# EAGLE design ir_validator (EAGLE 9.6.2)
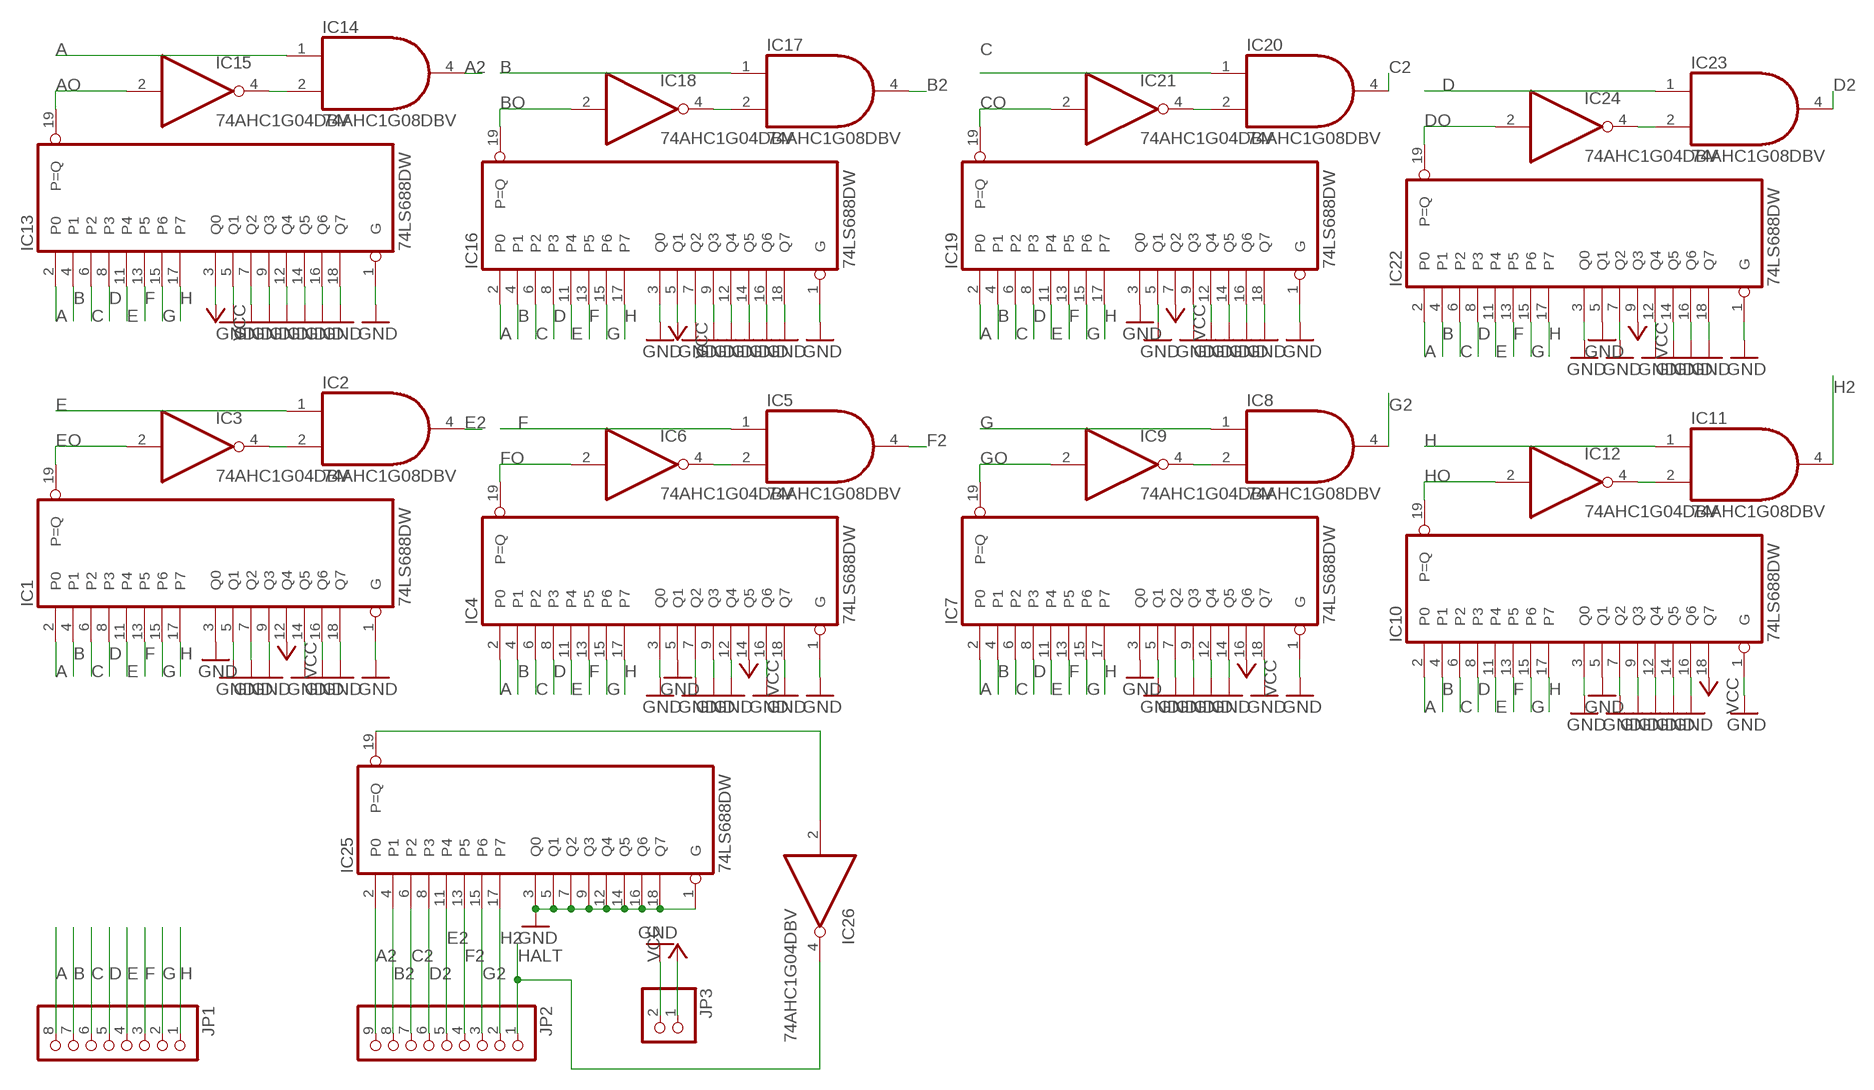
[diagram p0: schematic, sheet 1]

## Parts
IC1  74LS688DW  [SO20W]
IC2  74AHC1G08DBV  [SOT23-5]
IC3  74AHC1G04DBV  [SOT23-5]
IC4  74LS688DW  [SO20W]
IC5  74AHC1G08DBV  [SOT23-5]
IC6  74AHC1G04DBV  [SOT23-5]
IC7  74LS688DW  [SO20W]
IC8  74AHC1G08DBV  [SOT23-5]
IC9  74AHC1G04DBV  [SOT23-5]
IC10  74LS688DW  [SO20W]
IC11  74AHC1G08DBV  [SOT23-5]
IC12  74AHC1G04DBV  [SOT23-5]
IC13  74LS688DW  [SO20W]
IC14  74AHC1G08DBV  [SOT23-5]
IC15  74AHC1G04DBV  [SOT23-5]
IC16  74LS688DW  [SO20W]
IC17  74AHC1G08DBV  [SOT23-5]
IC18  74AHC1G04DBV  [SOT23-5]
IC19  74LS688DW  [SO20W]
IC20  74AHC1G08DBV  [SOT23-5]
IC21  74AHC1G04DBV  [SOT23-5]
IC22  74LS688DW  [SO20W]
IC23  74AHC1G08DBV  [SOT23-5]
IC24  74AHC1G04DBV  [SOT23-5]
IC25  74LS688DW  [SO20W]
IC26  74AHC1G04DBV  [SOT23-5]
JP1  PINHD-1X8  [1X08]
JP2  PINHD-1X9  [1X09]
JP3  PINHD-1X2  [1X02]

## Nets
A: IC1.2(P0) IC4.2(P0) IC7.2(P0) IC10.2(P0) IC13.2(P0) IC14.1(I0) IC16.2(P0) IC19.2(P0) IC22.2(P0) JP1.8
A2: IC14.4(O) IC25.2(P0) JP2.9
AO: IC13.19(P=Q) IC15.2(I)
B: IC1.4(P1) IC4.4(P1) IC7.4(P1) IC10.4(P1) IC13.4(P1) IC16.4(P1) IC17.1(I0) IC19.4(P1) IC22.4(P1) JP1.7
B2: IC17.4(O) IC25.4(P1) JP2.8
BO: IC16.19(P=Q) IC18.2(I)
C: IC1.6(P2) IC4.6(P2) IC7.6(P2) IC10.6(P2) IC13.6(P2) IC16.6(P2) IC19.6(P2) IC20.1(I0) IC22.6(P2) JP1.6
C2: IC20.4(O) IC25.6(P2) JP2.7
CO: IC19.19(P=Q) IC21.2(I)
D: IC1.8(P3) IC4.8(P3) IC7.8(P3) IC10.8(P3) IC13.8(P3) IC16.8(P3) IC19.8(P3) IC22.8(P3) IC23.1(I0) JP1.5
D2: IC23.4(O) IC25.8(P3) JP2.6
DO: IC22.19(P=Q) IC24.2(I)
E: IC1.11(P4) IC2.1(I0) IC4.11(P4) IC7.11(P4) IC10.11(P4) IC13.11(P4) IC16.11(P4) IC19.11(P4) IC22.11(P4) JP1.4
E2: IC2.4(O) IC25.11(P4) JP2.5
EO: IC1.19(P=Q) IC3.2(I)
F: IC1.13(P5) IC4.13(P5) IC5.1(I0) IC7.13(P5) IC10.13(P5) IC13.13(P5) IC16.13(P5) IC19.13(P5) IC22.13(P5) JP1.3
F2: IC5.4(O) IC25.13(P5) JP2.4
FO: IC4.19(P=Q) IC6.2(I)
G: IC1.15(P6) IC4.15(P6) IC7.15(P6) IC8.1(I0) IC10.15(P6) IC13.15(P6) IC16.15(P6) IC19.15(P6) IC22.15(P6) JP1.2
G2: IC8.4(O) IC25.15(P6) JP2.3
GND: IC1.1(G) IC1.3(Q0) IC1.5(Q1) IC1.7(Q2) IC1.9(Q3) IC1.14(Q5) IC1.16(Q6) IC1.18(Q7) IC4.1(G) IC4.3(Q0) IC4.5(Q1) IC4.7(Q2) IC4.9(Q3) IC4.12(Q4) IC4.16(Q6) IC4.18(Q7) IC7.1(G) IC7.3(Q0) IC7.5(Q1) IC7.7(Q2) IC7.9(Q3) IC7.12(Q4) IC7.14(Q5) IC7.18(Q7) IC10.1(G) IC10.3(Q0) IC10.5(Q1) IC10.7(Q2) IC10.9(Q3) IC10.12(Q4) IC10.14(Q5) IC10.16(Q6) IC13.1(G) IC13.5(Q1) IC13.7(Q2) IC13.9(Q3) IC13.12(Q4) IC13.14(Q5) IC13.16(Q6) IC13.18(Q7) IC16.1(G) IC16.3(Q0) IC16.7(Q2) IC16.9(Q3) IC16.12(Q4) IC16.14(Q5) IC16.16(Q6) IC16.18(Q7) IC19.1(G) IC19.3(Q0) IC19.5(Q1) IC19.9(Q3) IC19.12(Q4) IC19.14(Q5) IC19.16(Q6) IC19.18(Q7) IC22.1(G) IC22.3(Q0) IC22.5(Q1) IC22.7(Q2) IC22.12(Q4) IC22.14(Q5) IC22.16(Q6) IC22.18(Q7) IC25.1(G) IC25.3(Q0) IC25.5(Q1) IC25.7(Q2) IC25.9(Q3) IC25.12(Q4) IC25.14(Q5) IC25.16(Q6) IC25.18(Q7) JP3.2
GO: IC7.19(P=Q) IC9.2(I)
H: IC1.17(P7) IC4.17(P7) IC7.17(P7) IC10.17(P7) IC11.1(I0) IC13.17(P7) IC16.17(P7) IC19.17(P7) IC22.17(P7) JP1.1
H2: IC11.4(O) IC25.17(P7) JP2.2
HALT: IC26.4(O) JP2.1
HO: IC10.19(P=Q) IC12.2(I)
N$1: IC25.19(P=Q) IC26.2(I)
N$2: IC2.2(I1) IC3.4(O)
N$4: IC5.2(I1) IC6.4(O)
N$6: IC8.2(I1) IC9.4(O)
N$8: IC11.2(I1) IC12.4(O)
N$10: IC14.2(I1) IC15.4(O)
N$12: IC17.2(I1) IC18.4(O)
N$14: IC20.2(I1) IC21.4(O)
N$16: IC23.2(I1) IC24.4(O)
VCC: IC1.12(Q4) IC4.14(Q5) IC7.16(Q6) IC10.18(Q7) IC13.3(Q0) IC16.5(Q1) IC19.7(Q2) IC22.9(Q3) JP3.1

## Power pins joined to a net without a drawn wire
GND: IC1.10(GND) IC2.3(GND) IC3.3(GND) IC4.10(GND) IC5.3(GND) IC6.3(GND) IC7.10(GND) IC8.3(GND) IC9.3(GND) IC10.10(GND) IC11.3(GND) IC12.3(GND) IC13.10(GND) IC14.3(GND) IC15.3(GND) IC16.10(GND) IC17.3(GND) IC18.3(GND) IC19.10(GND) IC20.3(GND) IC21.3(GND) IC22.10(GND) IC23.3(GND) IC24.3(GND) IC25.10(GND) IC26.3(GND)
VCC: IC1.20(VCC) IC2.5(VCC) IC3.5(VCC) IC4.20(VCC) IC5.5(VCC) IC6.5(VCC) IC7.20(VCC) IC8.5(VCC) IC9.5(VCC) IC10.20(VCC) IC11.5(VCC) IC12.5(VCC) IC13.20(VCC) IC14.5(VCC) IC15.5(VCC) IC16.20(VCC) IC17.5(VCC) IC18.5(VCC) IC19.20(VCC) IC20.5(VCC) IC21.5(VCC) IC22.20(VCC) IC23.5(VCC) IC24.5(VCC) IC25.20(VCC) IC26.5(VCC)

## Library data of the parts
IC1 IC4 IC7 IC10 IC13 IC16 IC19 IC22 IC25 = 74xx-us:74*688: 8-bit MAGNITUDE/IDENTITY COMPARATOR, totem pole
IC2 IC5 IC8 IC11 IC14 IC17 IC20 IC23 = 74xx-little-us:74*1G08: 2-input AND gate
IC3 IC6 IC9 IC12 IC15 IC18 IC21 IC24 IC26 = 74xx-little-us:74*1G04: INVERTER Gate
JP1 = pinhead:PINHD-1X8: PIN HEADER
JP2 = pinhead:PINHD-1X9: PIN HEADER
JP3 = pinhead:PINHD-1X2: PIN HEADER

## Board
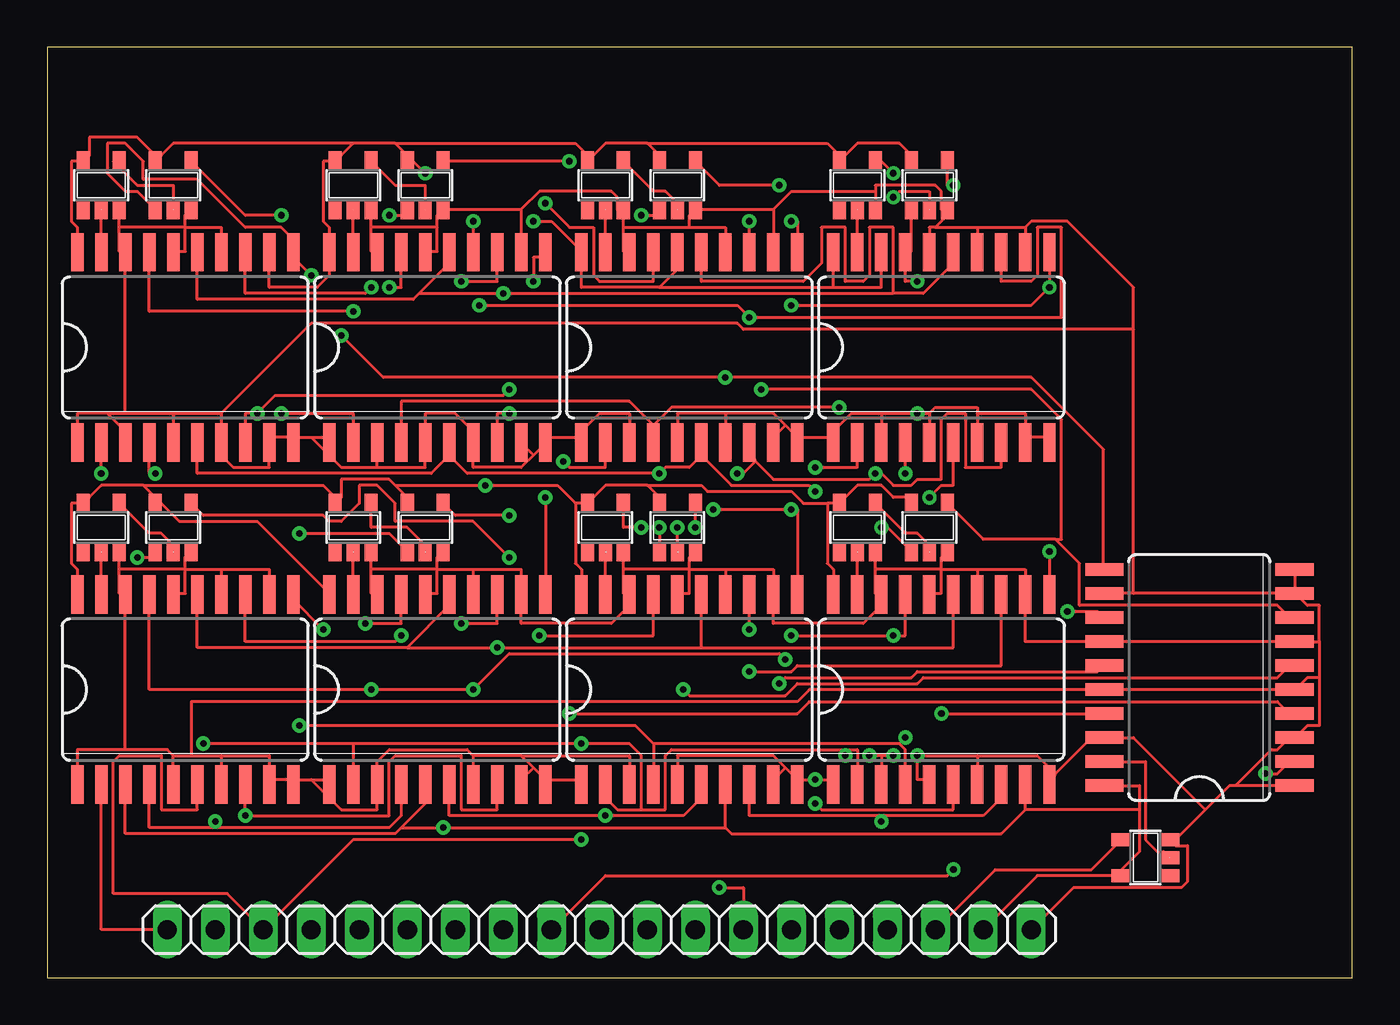
[diagram p1: board, top side]
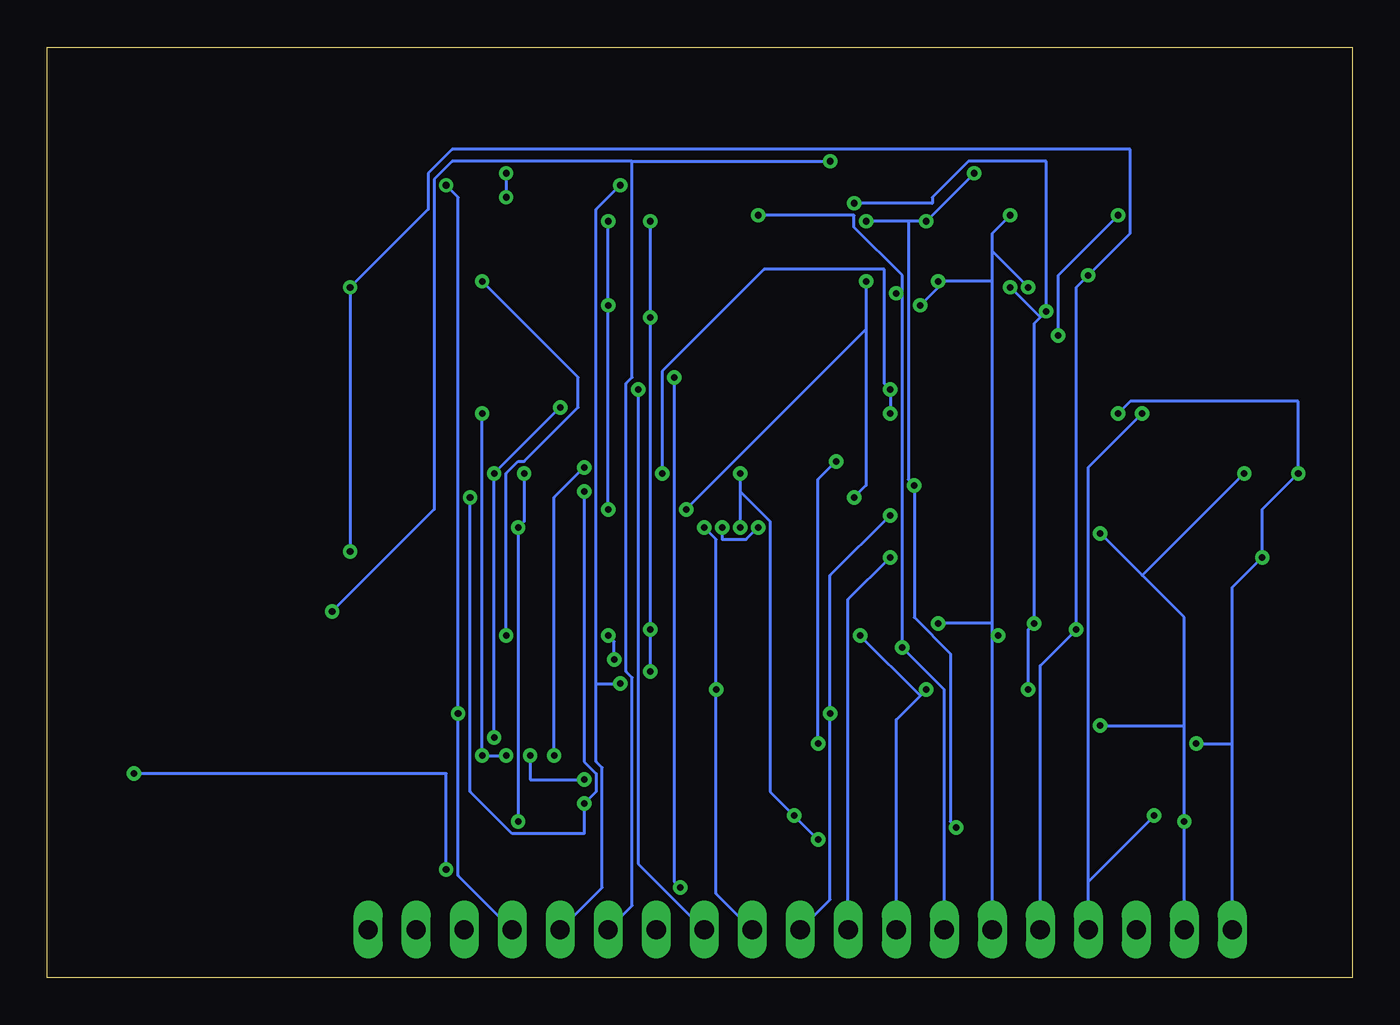
[diagram p2: board, bottom side, seen from below]

Size 69.05 x 49.21 mm. Coordinates in mm from the lower left corner, seen from the top.
Outline: 0,49.21 0,0 69.05,0 69.05,49.2 0,49.2
Copper layers (1*16): Top 0.035mm / dielectric 1.5mm / Bottom 0.035mm
Design rules "default": minimum track width 6mil, minimum drill 0.35mm, track to track 6mil, track to pad 6mil, pad to pad 6mil, via to via 6mil, smd to smd 6mil, copper to edge 40mil, drill to drill 6mil, minimum pad ring 10mil, minimum via ring 8mil, stop-mask expansion 4mil, vias tented up to drill 0mil, thermal gap 10mil

### Footprints (pad centres in the part's own frame; a part is rotated, then mirrored left to right if it is on the bottom)
SO20W = smd 0.66 x 2.032: 1 -5.715,-5.029; 2 -4.445,-5.029; 3 -3.175,-5.029; 4 -1.905,-5.029; 5 -0.635,-5.029; 6 0.635,-5.029; 7 1.905,-5.029; 8 3.175,-5.029; 9 4.445,-5.029; 10 5.715,-5.029; 11 5.715,5.029; 12 4.445,5.029; 13 3.175,5.029; 14 1.905,5.029; 15 0.635,5.029; 16 -0.635,5.029; 17 -1.905,5.029; 18 -3.175,5.029; 19 -4.445,5.029; 20 -5.715,5.029
SOT23-5 = smd 0.69 x 0.99: 1 -0.95,-1.29; 2 0,-1.29; 3 0.95,-1.29; 4 0.95,1.3; 5 -0.95,1.3
1X08 = drill 1.016 long: 1 -8.89,0; 2 -6.35,0; 3 -3.81,0; 4 -1.27,0; 5 1.27,0; 6 3.81,0; 7 6.35,0; 8 8.89,0
1X09 = drill 1.016 long: 1 -10.16,0; 2 -7.62,0; 3 -5.08,0; 4 -2.54,0; 5 0,0; 6 2.54,0; 7 5.08,0; 8 7.62,0; 9 10.16,0
1X02 = drill 1.016 long: 1 -1.27,0; 2 1.27,0

### Placement (x,y rotation side)
IC1  7.3,33.34 0 top
IC2  6.67,41.91 0 top
IC3  2.86,41.91 0 top
IC4  20.64,33.34 0 top
IC5  20,41.91 0 top
IC6  16.19,41.91 0 top
IC7  33.97,33.34 0 top
IC8  33.34,41.91 0 top
IC9  29.53,41.91 0 top
IC10  47.31,33.34 0 top
IC11  46.67,41.91 0 top
IC12  42.86,41.91 0 top
IC13  7.3,15.24 0 top
IC14  6.67,23.81 0 top
IC15  2.86,23.81 0 top
IC16  20.64,15.24 0 top
IC17  20,23.81 0 top
IC18  16.19,23.81 0 top
IC19  33.97,15.24 0 top
IC20  33.34,23.81 0 top
IC21  29.53,23.81 0 top
IC22  47.31,15.24 0 top
IC23  46.67,23.81 0 top
IC24  42.86,23.81 0 top
IC25  60.96,15.88 90 top
IC26  58.1,6.35 90 top
JP1  15.24,2.54 180 top
JP2  36.83,2.54 180 top
JP3  50.8,2.54 0 top

### Tracks (layer width: path | path; a pad name or v marks a point on that pad's centre or on a via)
A  (via drill 0.35)
  Top 0.152: v4.76,22.23 5.71,22.23 IC14.1 | IC13.2 2.86,2.54 JP1.8 | v2.86,26.67 IC1.2 | IC4.2 16.19,29.84 v12.38,29.84 | 16.19,12.38 IC16.2 | 16.19,12.38 v28.26,12.38 30.8,12.38 31.43,11.75 31.43,8.89 | 31.43,8.89 30.16,8.89 29.53,9.53 IC19.2 | IC22.2 42.86,12.06 42.23,12.06 | 42.23,12.06 33.02,12.06 32.7,11.75 32.7,8.89 31.43,8.89 | IC7.2 29.53,26.99 27.62,26.99 v27.3,27.3 | IC10.2 42.86,26.99 v40.64,26.99 | 42.23,12.06 v42.23,11.75 | 16.19,12.38 v8.26,12.38
  Bottom 0.152: JP1.8 6.35,12.38 | 6.35,12.38 6.35,20.64 v4.76,22.23 4.76,24.77 v2.86,26.67 2.86,30.48 11.75,30.48 v12.38,29.84 | v27.3,27.3 28.26,26.35 v28.26,12.38 | v40.64,26.99 42.23,25.4 v42.23,11.75 | v8.26,12.38 6.35,12.38
A2  (via drill 0.35)
  Top 0.152: v24.45,22.23 22.54,24.13 18.41,24.13 18.41,25.08 17.46,26.04 16.51,26.04 16.51,25.08 15.56,24.13 14.92,24.13 14.61,24.45 8.26,24.45 7.62,25.08 IC14.4 | v64.45,10.79 65.09,10.79 65.72,11.43 IC25.2 | v47.94,5.71 47.62,5.4 29.53,5.4 JP2.9
  Bottom 0.152: v24.45,22.23 26.67,20 JP2.9 | v64.45,10.79 47.94,10.79 v47.94,5.71
AO
  Top 0.152: IC13.19 IC15.2
B  (via drill 0.35)
  Top 0.152: IC13.4 5.4,7.94 8.89,7.94 | 8.89,7.94 18.1,7.94 18.73,8.57 IC16.4 | v13.34,23.5 18.1,23.5 19.05,22.54 IC17.1 | IC1.4 5.4,26.67 v5.71,26.67 | v8.89,8.26 8.89,7.94 | IC4.4 18.73,30.48 30.8,30.48 32.07,29.21 | 32.07,29.21 IC7.4 32.07,28.57 | 32.07,12.38 IC19.4 | 45.09,12.38 32.07,12.38 | 45.09,12.38 45.4,12.06 IC22.4 | v45.4,26.67 IC10.4 | 45.09,12.38 v45.4,12.7 | 32.07,29.21 33.02,30.16 v41.91,30.16 | v13.34,13.34 31.11,13.34 32.07,12.38
  Bottom 0.152: 11.11,21.27 8.89,19.05 8.89,13.34 | 11.11,21.27 v13.34,23.5 | JP1.7 v8.89,8.26 8.89,13.34 | 11.11,21.27 v5.71,26.67 | v45.4,12.7 v45.4,26.67 v41.91,30.16 | v13.34,13.34 8.89,13.34
B2  (via drill 0.35)
  Top 0.152: v24.45,24.45 21.59,24.45 20.95,25.08 IC17.4 | v27.62,13.97 39.69,13.97 40.32,14.61 65.09,14.61 65.72,13.97 IC25.4
  Bottom 0.152: v24.45,24.45 27.62,21.27 v27.62,13.97 27.62,4.13 JP2.8
BO
  Top 0.152: IC16.19 IC18.2
C  (via drill 0.35)
  Top 0.152: IC13.6 7.94,8.89 6.03,8.89 6.03,11.75 3.81,11.75 3.49,11.43 3.49,4.45 9.53,4.45 JP1.6 16.19,7.3 v28.26,7.3 | IC1.6 7.94,26.67 20.32,26.67 21.27,27.62 | IC4.6 21.27,27.62 | IC16.6 21.27,8.57 v29.53,8.57 33.66,8.57 34.61,9.53 IC19.6 | v32.38,23.81 32.38,22.54 IC20.1 | 34.61,27.62 33.97,26.99 32.7,26.99 v32.38,26.67 22.23,26.67 21.27,27.62 | IC7.6 34.61,27.62 | IC22.6 47.94,8.89 40.96,8.89 v40.64,9.21 | v40.64,25.72 40.32,26.04 36.2,26.04 34.61,27.62 | IC10.6 47.94,26.04 47.31,26.04 v46.67,25.4
  Bottom 0.152: v32.38,26.67 32.38,25.72 | 32.38,25.72 v32.38,23.81 | v40.64,25.72 40.64,11.43 40.01,10.79 40.01,9.84 v40.64,9.21 40.64,7.62 44.45,7.62 46.67,9.84 v46.67,25.4 | 32.38,25.72 30.8,24.13 30.8,9.84 v29.53,8.57 v28.26,7.3
C2  (via drill 0.35)
  Top 0.152: v34.29,23.81 34.29,25.08 IC20.4 | v33.66,15.24 33.97,14.92 39.05,14.92 39.69,15.56 46.04,15.56 46.35,15.88 65.09,15.88 65.72,16.51 IC25.6
  Bottom 0.152: v34.29,23.81 33.66,23.18 v33.66,15.24 33.66,4.45 JP2.7
CO
  Top 0.152: IC19.19 IC21.2
D  (via drill 0.35)
  Top 0.152: IC19.8 37.15,8.57 44.13,8.57 | 44.13,8.57 49.53,8.57 50.48,9.53 IC22.8 | v44.13,23.81 44.45,23.81 45.72,22.54 IC23.1 | 37.47,27.3 37.15,27.62 IC7.8 37.47,27.3 | 37.47,27.3 38.42,26.35 43.5,26.35 v43.81,26.67 44.13,26.67 44.77,26.04 45.72,26.04 46.04,26.35 47.31,26.35 47.31,29.53 47.62,29.84 48.58,29.84 48.58,26.99 50.48,26.99 IC10.8 | v44.13,8.26 44.13,8.57 | IC13.8 v10.48,8.57 18.1,8.57 18.1,11.43 18.41,11.75 21.91,11.75 21.91,8.89 23.81,8.89 IC16.8 | IC1.8 10.48,29.84 v11.11,29.84 12.06,30.8 24.13,30.8 v24.45,31.11 | IC4.8 23.81,29.84 v24.45,29.84 | 37.47,27.3 36.83,26.67 v36.51,26.67
  Bottom 0.152: v43.81,26.67 43.81,24.13 v44.13,23.81 v44.13,8.26 | 13.97,5.08 v10.48,8.57 | JP1.5 13.97,5.08 | v11.11,29.84 13.97,26.99 13.97,5.08 | v24.45,29.84 v24.45,31.11 24.77,31.43 24.77,37.47 31.11,37.47 36.51,32.07 v36.51,26.67
D2  (via drill 0.35)
  Top 0.152: 53.34,23.18 49.53,23.18 47.62,25.08 IC23.4 | 53.34,23.18 54.61,21.91 54.61,19.68 65.09,19.68 65.72,19.05 IC25.8 | v37.78,31.11 52.07,31.11 53.66,29.53 53.66,23.18 53.34,23.18
  Bottom 0.152: JP2.6 37.78,6.03 v37.78,31.11
DO
  Top 0.152: IC22.19 IC24.2
E  (via drill 0.35)
  Top 0.152: v53.02,22.54 IC22.11 | IC10.11 v53.02,36.51 52.07,35.56 v39.37,35.56 | v26.35,25.4 IC16.11 | v25.72,36.83 25.72,38.1 26.35,38.1 IC4.11 | IC19.11 39.69,24.77 v39.37,24.77 v35.24,24.77 | IC7.11 39.69,40.01 v39.37,40.01 | IC2.1 5.71,40.64 4.76,41.59 4.13,41.59 3.17,42.55 3.17,44.13 4.13,44.13 5.08,43.18 5.08,42.23 7.94,42.23 10.48,39.69 12.38,39.69 13.02,39.05 IC1.11 13.02,38.1 v13.97,37.15 | v14.61,18.41 13.02,20 IC13.11
  Bottom 0.152: v53.02,22.54 v53.02,36.51 48.9,40.64 48.9,42.55 47.62,43.81 11.75,43.81 11.75,39.37 v13.97,37.15 14.61,36.51 v14.61,18.41 16.51,16.51 JP1.4 | v26.35,25.4 25.72,26.04 25.72,34.29 | v25.72,36.83 25.72,34.29 | 25.72,34.29 v35.24,24.77 | v39.37,24.77 v39.37,35.56 v39.37,40.01
E2  (via drill 0.35)
  Top 0.152: v12.38,40.32 10.48,40.32 7.62,43.18 IC2.4 | v15.56,33.97 17.78,31.75 v35.88,31.75 52.07,31.75 55.88,27.94 55.88,21.59 IC25.11 | JP2.5 36.83,4.76 v35.56,4.76
  Bottom 0.152: v12.38,40.32 15.56,37.15 v15.56,33.97 | v35.56,4.76 35.88,5.08 v35.88,31.75
EO
  Top 0.152: IC1.19 IC3.2
F  (via drill 0.35)
  Top 0.152: v37.15,18.41 IC19.13 | IC7.13 v37.15,40.01 | IC22.13 50.48,16.51 39.69,16.51 39.37,16.19 v37.15,16.19 | IC10.13 50.48,36.83 52.07,36.83 52.39,37.15 52.39,39.69 53.66,39.69 53.66,34.92 v37.15,34.92 36.51,35.56 v22.86,35.56 | v18.1,40.32 19.05,40.32 IC5.1 | IC13.13 10.48,17.78 18.41,17.78 v18.73,18.1 | IC16.13 23.81,18.73 v21.91,18.73 | IC1.13 10.48,36.2 16.83,36.2 v17.14,36.51 | IC4.13 23.81,36.83 v21.91,36.83
  Bottom 0.152: v37.15,40.01 v37.15,34.92 v37.15,18.41 v37.15,16.19 | v18.1,40.32 19.05,39.37 19.05,38.42 | JP1.3 19.05,18.1 | 19.05,18.1 19.05,18.73 | 19.05,18.73 19.05,36.83 | 19.05,36.83 19.05,38.42 | 19.05,18.1 v18.73,18.1 | 19.05,18.73 v21.91,18.73 | 19.05,38.42 v17.14,36.51 | 19.05,36.83 v21.91,36.83 21.91,36.51 v22.86,35.56
F2  (via drill 0.35)
  Top 0.152: v27.62,43.18 20.95,43.18 IC5.4 | v53.98,19.37 55.56,19.37 55.88,19.05 IC25.13
  Bottom 0.152: 38.1,43.18 v27.62,43.18 | 38.1,43.18 38.1,31.75 38.42,31.43 38.42,16.19 38.1,15.88 38.1,3.81 JP2.4 | v53.98,19.37 48.58,24.77 48.58,42.23 47.62,43.18 38.1,43.18
FO
  Top 0.152: IC4.19 IC6.2
G  (via drill 0.35)
  Top 0.152: IC13.15 7.94,17.46 19.05,17.46 | 19.05,17.46 21.27,19.68 IC16.15 | 34.61,17.46 IC19.15 | 19.05,17.46 v23.81,17.46 34.61,17.46 | IC22.15 47.94,17.46 34.61,17.46 | IC7.15 34.61,36.83 40.01,36.83 40.96,37.78 40.96,39.69 42.23,39.69 42.23,36.83 43.18,36.83 43.5,37.15 43.5,39.69 44.77,39.69 44.77,36.2 | 44.77,36.2 46.35,36.2 47.94,37.78 IC10.15 | IC1.15 7.94,35.88 19.37,35.88 19.68,36.2 | 19.68,36.2 21.27,37.78 IC4.15 | 19.68,36.2 v24.13,36.2 44.77,36.2 | v31.43,40.32 32.38,40.32 IC8.1
  Bottom 0.152: v31.43,40.32 26.35,40.32 26.35,39.69 23.81,37.15 23.81,36.2 | 23.81,36.2 v23.81,17.46 21.59,15.24 JP1.2 | 23.81,36.2 v24.13,36.2
G2  (via drill 0.35)
  Top 0.152: v38.73,41.91 35.56,41.91 34.29,43.18 IC8.4 | v38.73,15.56 39.05,15.88 45.72,15.88 46.04,16.19 55.56,16.19 55.88,16.51 IC25.15
  Bottom 0.152: v38.73,41.91 40.01,40.64 40.01,15.56 | 40.01,15.56 40.01,11.43 39.69,11.11 39.69,4.76 JP2.3 | 40.01,15.56 v38.73,15.56
GND  (via drill 0.35)
  Top 0.152: 61.28,8.89 62.55,10.16 62.87,10.16 | 61.28,8.89 59.69,7.3 IC26.3 59.69,6.99 60.33,6.99 60.33,5.08 60.01,4.76 54.29,4.76 JP3.2 | IC25.1 62.87,10.16 | 62.87,10.16 64.77,12.06 65.09,12.06 65.72,12.7 IC25.3 66.04,12.7 66.67,13.34 67.31,13.34 67.31,15.88 | 51.75,28.57 53.02,28.57 IC10.10 | IC7.5 33.34,29.84 35.88,29.84 | 35.88,29.84 38.42,29.84 39.05,29.21 | 39.69,28.57 39.05,29.21 | 35.88,29.84 IC7.7 | 39.05,29.21 38.42,28.57 IC7.9 | 39.69,28.57 41.27,28.57 | 41.27,28.57 41.59,28.57 IC10.1 41.27,28.57 | 39.69,28.57 IC7.10 | 44.13,29.84 IC10.3 | 44.13,29.84 42.55,29.84 41.27,28.57 | 46.67,29.84 IC10.5 | 44.13,29.84 v46.04,29.84 46.67,29.84 | 49.21,29.84 49.21,30.16 46.99,30.16 46.67,29.84 | 49.21,29.84 IC10.7 | 51.75,28.57 51.75,29.84 49.21,29.84 | 51.75,28.57 IC10.9 | IC19.5 33.34,11.75 38.42,11.75 39.05,11.11 | 39.69,10.48 39.05,11.11 | 39.05,11.11 38.42,10.48 IC19.9 | 39.69,10.48 v40.64,10.48 41.59,10.48 IC22.1 | 39.69,10.48 IC19.10 | 53.34,10.79 55.24,12.7 IC25.18 57.47,12.7 61.28,8.89 | 53.34,10.79 53.02,10.48 IC22.10 53.34,10.79 | 44.13,11.75 IC22.3 | v44.77,11.75 44.13,11.75 | IC22.5 46.67,10.48 46.04,10.48 v46.04,11.75 49.21,11.75 | 49.21,11.75 IC22.7 | 53.34,10.79 52.39,11.75 49.21,11.75 | 44.13,11.75 v43.5,11.75 | 13.02,28.57 11.75,28.57 IC1.9 11.75,26.99 9.84,26.99 9.21,27.62 IC1.7 9.21,29.84 | 13.02,28.57 13.97,28.57 | 13.97,28.57 14.92,28.57 IC4.1 | 13.02,28.57 IC1.10 | 17.46,26.99 IC4.3 | 17.46,26.99 15.56,26.99 13.97,28.57 | 17.46,26.99 20,26.99 IC4.5 20,29.84 21.59,29.84 22.54,28.89 IC4.7 22.54,26.99 25.08,26.99 25.72,27.62 | 25.72,27.62 26.35,28.26 IC4.10 26.35,28.57 27.94,28.57 | 25.72,27.62 25.08,28.26 IC4.9
  Top 0.152: 27.94,28.57 28.26,28.57 IC7.1 27.94,28.57 | IC7.3 30.8,29.84 29.21,29.84 27.94,28.57 | 3.81,39.69 3.81,38.42 4.13,38.42 IC1.18 4.13,29.84 | 3.81,39.69 3.81,40.32 IC3.3 | 7.3,39.69 7.3,38.42 6.67,38.42 IC1.16 | 7.3,39.69 7.3,40.32 IC2.3 | IC1.14 9.21,39.69 7.3,39.69 | 7.3,39.69 3.81,39.69 | IC1.1 1.59,29.84 3.17,29.84 | 3.17,29.84 4.13,28.89 IC1.3 | 6.67,29.84 IC1.5 | 3.17,29.84 4.13,29.84 | 4.13,29.84 6.67,29.84 | 6.67,29.84 9.21,29.84 | 3.81,21.59 3.81,20.32 4.13,20.32 IC13.18 4.13,12.06 | 3.81,21.59 3.81,22.23 IC15.3 | 7.3,21.59 7.3,20.32 6.67,20.32 IC13.16 | 7.3,21.59 7.3,22.23 IC14.3 | 9.21,21.59 IC13.14 | 7.3,21.59 9.21,21.59 | IC13.12 11.75,21.59 9.21,21.59 | 7.3,21.59 3.81,21.59 | 22.54,11.75 IC16.7 | 25.08,11.75 22.54,11.75 | 26.35,10.48 25.72,11.11 | 25.72,11.11 25.08,11.75 | 25.72,11.11 25.08,10.48 IC16.9 | 26.35,10.48 28.26,10.48 IC19.1 | 26.35,10.48 IC16.10 | IC19.3 30.8,11.75 25.08,11.75 | 13.02,10.48 11.75,10.48 | 13.02,10.48 13.97,10.48 | 13.97,10.48 14.92,10.48 IC16.1 | 13.02,10.48 IC13.10 | 13.97,10.48 15.56,8.89 17.46,8.89 IC16.3 17.46,11.43 18.1,12.06 22.23,12.06 22.54,11.75 | IC13.1 1.59,12.06 4.13,12.06 | 4.13,12.06 6.35,12.06 6.67,11.75 | IC13.5 6.67,11.75 | 9.21,11.75 IC13.7 | 6.67,11.75 7.62,11.75 | 7.62,11.75 9.21,11.75 | 11.75,10.48 11.75,11.75 9.21,11.75 | 11.75,10.48 IC13.9 | 43.81,41.59 43.81,41.91 46.99,41.91 47.31,41.59 47.31,40.64 IC11.3 47.62,40.32 46.99,39.69 | 43.81,41.59 43.81,40.64 IC12.3 | IC10.16 46.67,39.69 46.99,39.69 | 49.21,39.69 IC10.14 | 46.99,39.69 49.21,39.69 | 51.75,39.69 IC10.12 | 49.21,39.69 51.75,39.69 | 17.14,39.69 17.14,38.42 17.46,38.42 IC4.18 | 17.14,39.69 17.14,40.32 IC6.3
  Top 0.152: 20.64,39.69 20.64,38.42 20,38.42 IC4.16 | 20.64,39.69 20.64,40.32 IC5.3 20.95,40.64 25.08,40.64 | 25.08,40.64 IC4.12 | 20.64,39.69 17.14,39.69 | 30.48,39.69 30.48,38.42 30.8,38.42 IC7.18 | 30.48,39.69 30.48,40.32 IC9.3 30.16,40.64 30.16,41.27 29.84,41.59 26.04,41.59 25.08,40.64 | 33.97,39.69 33.97,40.32 IC8.3 34.29,40.64 38.42,40.64 | 30.48,39.69 33.97,39.69 | IC7.14 35.88,39.69 33.97,39.69 | 38.42,40.64 IC7.12 | 43.81,41.59 39.37,41.59 38.42,40.64 | 17.14,21.59 17.14,20.32 17.46,20.32 IC16.18 | 17.14,21.59 17.14,22.23 IC18.3 | 20.64,21.59 20.64,20.32 20,20.32 IC16.16 | 20.64,21.59 20.64,22.23 IC17.3 | 22.54,21.59 IC16.14 | 20.64,21.59 22.54,21.59 | 22.54,21.59 25.08,21.59 IC16.12 25.08,18.73 29.84,18.73 30.8,19.68 IC19.18 30.8,20.32 30.48,20.32 30.48,21.59 | 20.64,21.59 17.14,21.59 | 30.48,21.59 30.48,22.23 IC21.3 | 33.97,21.59 33.97,20.32 33.34,20.32 IC19.16 | 33.97,21.59 33.97,22.23 IC20.3 | 35.88,21.59 IC19.14 | 33.97,21.59 35.88,21.59 | 35.88,21.59 38.42,21.59 IC19.12 38.42,18.73 43.18,18.73 44.13,19.68 IC22.18 44.13,20.32 43.81,20.32 43.81,21.59 | 33.97,21.59 30.48,21.59 | 57.47,20.32 IC25.9 66.04,20.32 | 57.47,20.32 IC25.12 | 66.04,20.32 66.04,21.59 IC25.10 | 43.81,21.59 43.81,22.23 IC24.3 | 47.31,21.59 47.31,20.32 46.67,20.32 IC22.16 | 47.31,21.59 47.31,22.23 IC23.3 | 49.21,21.59 IC22.14 | 47.31,21.59 49.21,21.59 | 49.21,21.59 51.75,21.59 IC22.12 51.75,17.78 IC25.14 IC25.7 67.31,17.78 | 47.31,21.59 43.81,21.59 | 67.31,15.88 66.67,15.88 66.04,15.24 IC25.5 IC25.16 40.32,15.24 39.69,14.61 7.62,14.61 7.62,11.75 | 67.31,17.78 67.31,15.88 | 66.04,20.32 66.67,19.68 67.31,19.68 67.31,17.78
  Top 0.152: 51.75,39.69 52.07,40.01 53.98,40.01 57.47,36.51 57.47,34.29 | 57.47,20.32 57.47,34.29 | 9.21,29.84 13.97,34.61 36.51,34.61 36.83,34.29 57.47,34.29
  Bottom 0.152: v44.77,11.75 v46.04,11.75 v46.04,29.84 | v40.64,10.48 43.5,10.48 v43.5,11.75
GO
  Top 0.152: IC7.19 IC9.2
H  (via drill 0.35)
  Top 0.152: IC11.1 45.72,40.32 45.72,38.42 45.4,38.42 IC10.17 45.4,36.83 v46.04,36.83 | IC13.17 5.4,15.24 v17.14,15.24 v22.54,15.24 24.45,17.14 38.73,17.14 v39.05,16.83 | IC16.17 18.73,18.73 v16.83,18.73 | IC1.17 5.4,35.24 v16.19,35.24 | IC19.17 32.07,18.1 v26.04,18.1 | IC4.17 18.73,36.51 v18.1,36.51 | IC22.17 45.4,18.1 v44.77,18.1 v39.37,18.1 | IC7.17 32.07,36.83 29.21,36.83 28.89,37.15 28.89,39.69 27.62,39.69 v26.35,40.96
  Bottom 0.152: 22.86,14.92 24.13,13.65 JP1.1 | 22.86,14.92 v22.54,15.24 | v17.14,15.24 17.14,18.41 v16.83,18.73 16.83,34.61 16.51,34.92 | 16.51,34.92 v16.19,35.24 16.19,43.18 20.32,43.18 22.23,41.27 22.23,40.96 v26.35,40.96 | 22.86,14.92 v26.04,18.1 | 16.51,34.92 v18.1,36.51 | v39.37,18.1 39.05,17.78 v39.05,16.83 | v46.04,36.83 40.96,31.75 40.96,30.16 43.81,27.3 44.13,27.3 44.77,26.67 v44.77,18.1
H2  (via drill 0.35)
  Top 0.152: v47.94,41.91 47.62,41.91 47.62,43.18 IC11.4 | v47.31,13.97 IC25.17
  Bottom 0.152: v47.94,41.91 47.31,41.27 v47.31,13.97 47.31,5.4 JP2.2
HALT
  Top 0.152: JP2.1 50.16,5.71 55.24,5.71 56.52,6.99 IC26.4
HO
  Top 0.152: IC10.19 IC12.2
N$1
  Top 0.152: IC25.19 58.1,11.43 58.1,7.3 58.74,6.67 59.05,6.67 59.37,6.35 IC26.2
N$2
  Top 0.152: IC2.2 6.67,41.91 4.76,41.91 3.49,43.18 IC3.4
N$4
  Top 0.152: IC5.2 20,41.91 18.41,41.91 17.14,43.18 IC6.4
N$6
  Top 0.152: IC8.2 33.34,40.96 32.7,41.59 32.07,41.59 30.48,43.18 IC9.4
N$8  (via drill 0.35)
  Top 0.152: IC11.2 46.67,41.59 45.09,41.59 v44.77,41.27 | v44.77,42.55 44.13,43.18 43.81,43.18 IC12.4
  Bottom 0.152: v44.77,42.55 v44.77,41.27
N$10
  Top 0.152: IC14.2 6.67,22.86 6.03,23.5 5.4,23.5 3.81,25.08 IC15.4
N$12
  Top 0.152: IC17.2 20,22.86 19.05,23.81 17.14,23.81 17.14,25.08 IC18.4
N$14  (via drill 0.35)
  Top 0.152: v31.43,23.81 30.48,23.81 30.48,25.08 IC21.4 | IC20.2 v33.34,23.81
  Bottom 0.152: v31.43,23.81 32.07,23.18 33.34,23.18 v33.34,23.81
N$16
  Top 0.152: IC23.2 46.67,22.86 46.04,23.5 45.4,23.5 43.81,25.08 IC24.4
VCC  (via drill 0.35)
  Top 0.152: 57.78,8.89 57.78,10.16 IC25.20 | 57.78,8.89 57.78,6.67 56.83,5.71 IC26.5 56.52,5.4 52.39,5.4 JP3.1 | 51.75,8.89 IC22.9 | 57.78,8.89 51.75,8.89 | IC13.3 4.13,7.62 18.41,7.62 18.73,7.94 | 18.73,7.94 20,9.21 IC16.5 | 35.88,7.94 IC19.7 | 18.73,7.94 v20.95,7.94 35.88,7.94 | 51.75,8.89 50.48,7.62 36.2,7.62 35.88,7.94 | IC23.5 45.72,25.4 44.77,25.4 44.13,26.04 42.86,26.04 42.23,25.4 IC24.5 41.91,25.08 41.27,25.08 | IC22.20 41.59,21.59 41.27,21.91 41.27,25.08 | 31.75,26.04 29.53,26.04 28.89,25.4 IC21.5 28.57,25.08 27.94,25.08 | 31.75,26.04 32.38,25.4 IC20.5 | IC19.20 28.26,21.59 27.94,21.91 27.94,25.08 | 18.41,26.04 19.05,25.4 IC17.5 | 18.41,26.04 18.1,26.35 15.56,26.35 15.56,25.4 IC18.5 15.24,25.4 14.61,26.04 5.08,26.04 | 5.08,26.04 2.86,26.04 2.22,25.4 IC15.5 1.91,25.08 1.27,25.08 1.27,21.91 1.59,21.59 IC13.20 | 5.08,26.04 5.71,25.4 IC14.5 6.03,25.08 6.99,24.13 11.11,24.13 14.92,20.32 IC16.20 | 27.94,25.08 26.99,26.04 v23.18,26.04 18.41,26.04 | 41.27,25.08 40.01,25.08 39.37,25.72 34.92,25.72 34.61,26.04 31.75,26.04 | 32.38,36.51 28.26,36.51 IC7.20 28.26,38.42 26.67,40.01 v25.72,40.01 | 32.38,36.51 33.34,37.47 IC7.16 | 41.59,36.51 IC10.20 | 32.38,36.51 41.59,36.51 | IC10.18 44.13,36.51 41.59,36.51 | IC1.20 1.59,39.69 1.27,40.01 1.27,43.18 1.91,43.18 IC3.5 2.22,43.5 2.22,44.45 4.76,44.45 5.71,43.5 IC2.5 6.03,43.5 6.67,44.13 16.19,44.13 | IC1.12 11.75,36.51 14.29,36.51 14.92,37.15 IC4.20 14.92,39.69 14.61,40.01 14.61,43.18 15.24,43.18 IC6.5 15.56,43.5 16.19,44.13 | IC11.5 45.72,43.5 45.09,44.13 42.86,44.13 42.23,43.5 IC12.5 41.91,43.5 41.27,44.13 31.75,44.13 | 31.75,44.13 29.53,44.13 28.89,43.5 IC9.5 28.57,43.5 27.94,44.13 18.41,44.13
  Top 0.152: 31.75,44.13 32.38,43.5 IC8.5 | 18.41,44.13 16.19,44.13 | 18.41,44.13 19.05,43.5 IC5.5 19.37,43.18 v20,42.55 | v22.54,40.01 IC4.14
  Bottom 0.152: v20,42.55 v22.54,40.01 23.5,40.01 | 23.5,40.01 v25.72,40.01 | 23.5,40.01 23.5,26.35 v23.18,26.04 23.18,19.05 21.27,17.14 21.27,8.26 v20.95,7.94